# EAGLE schematic hud (EAGLE 7.6.0)
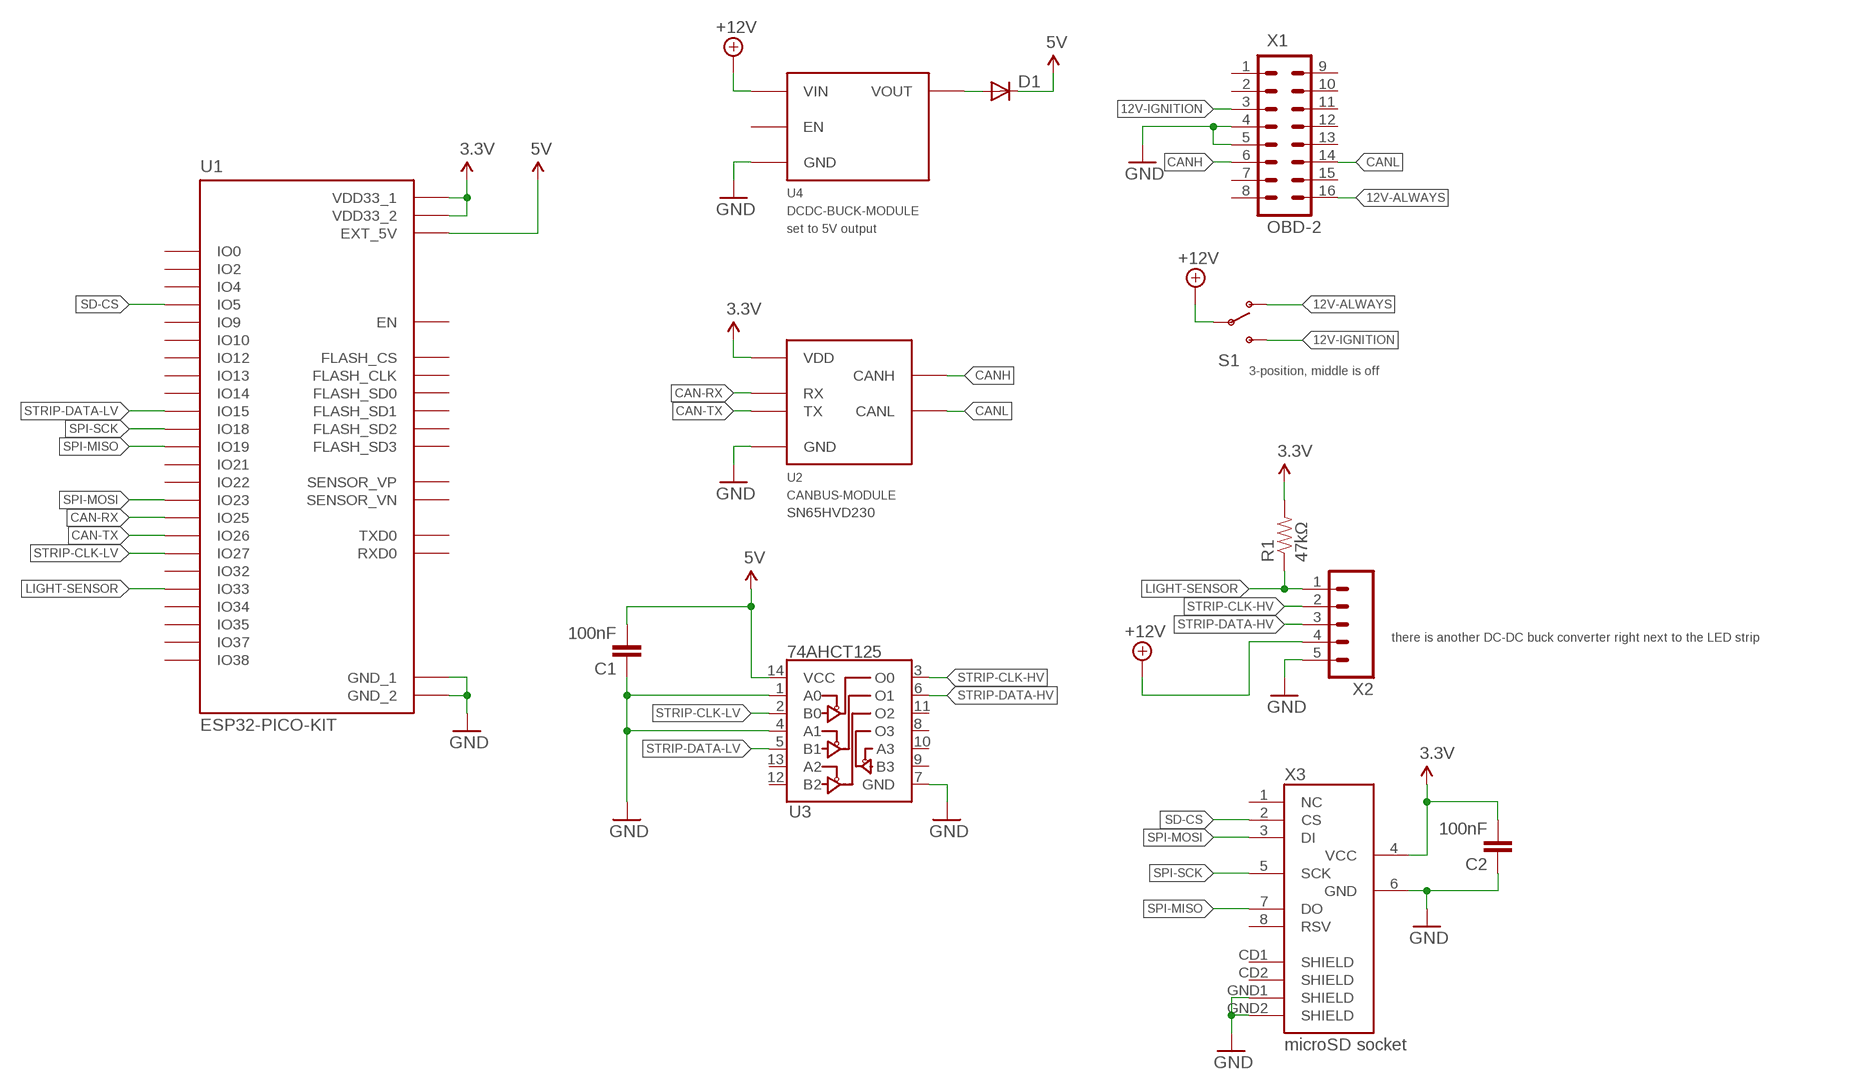
[diagram p0: schematic, sheet 1]

## Parts
C1  100nF  CAP0402-CAP  [0402-CAP]
C2  100nF  CAP0402-CAP  [0402-CAP]
D1  DIODE1N4148  [DIODE-1N4148]
R1  47kΩ  RESISTOR0805-RES  [0805]
S1  SWITCH-SPSTPTH  [SWITCH-SPDT]
U1  ESP32-PICO-KIT  [XCVR_ESP32-PICO-KIT]
U3  74AHCT125  74ACT125D  [SO014]
X1  OBD-2  M08X2  [2X8]
X2  M05PTH  [1X05]
X3  microSD socket  USD-SOCKETUSD  [USD-SOCKET-PP]

## Nets
3.3V: C2.2 R1.2 U1.J2_20(VDD33_1) U1.J3_18(VDD33_2) X3.4(VCC) ; supply symbol labelled CANBUS-MODULE
5V: C1.2 D1.C U1.J3_20(EXT_5V) U3.14(VCC)
12V-ALWAYS: S1.1(O) X1.16
12V-IGNITION: S1.3(S) X1.3
+12V: S1.2(P) X2.4 ; supply symbol labelled DCDC-BUCK-MODULE
CAN-RX: U1.J3_6(IO25) ; supply symbol labelled CANBUS-MODULE
CAN-TX: U1.J3_7(IO26) ; supply symbol labelled CANBUS-MODULE
CANH: X1.6 ; supply symbol labelled CANBUS-MODULE
CANL: X1.14 ; supply symbol labelled CANBUS-MODULE
GND: C1.1 C2.1 U1.J2_19(GND_1) U1.J3_19(GND_2) U3.1(A0) U3.4(A1) U3.7(GND) X1.4 X1.5 X2.5 X3.6(GND) X3.GND1(SHIELD) X3.GND2(SHIELD) ; supply symbol labelled CANBUS-MODULE, DCDC-BUCK-MODULE
LIGHT-SENSOR: R1.1 U1.J3_9(IO33) X2.1
SD-CS: U1.J2_9(IO5) X3.2(CS)
SPI-MISO: U1.J2_6(IO19) X3.7(DO)
SPI-MOSI: U1.J2_7(IO23) X3.3(DI)
SPI-SCK: U1.J2_8(IO18) X3.5(SCK)
STRIP-CLK-HV: U3.3(O0) X2.2
STRIP-CLK-LV: U1.J3_10(IO27) U3.2(B0)
STRIP-DATA-HV: U3.6(O1) X2.3
STRIP-DATA-LV: U1.J3_14(IO15) U3.5(B1)
VOUT: D1.A ; supply symbol labelled DCDC-BUCK-MODULE
Unconnected: U1.J2_1(FLASH_SD1) U1.J2_2(FLASH_SD3) U1.J2_3(FLASH_CLK) U1.J2_4(IO21) U1.J2_5(IO22) U1.J2_10(IO10) U1.J2_11(IO9) U1.J2_12(RXD0) U1.J2_13(TXD0) U1.J2_14(IO35) U1.J2_15(IO34) U1.J2_16(IO38) U1.J2_17(IO37) U1.J2_18(EN) U1.J3_1(FLASH_CS) U1.J3_2(FLASH_SD0) U1.J3_3(FLASH_SD2) U1.J3_4(SENSOR_VP) U1.J3_5(SENSOR_VN) U1.J3_8(IO32) U1.J3_11(IO14) U1.J3_12(IO12) U1.J3_13(IO13) U1.J3_15(IO2) U1.J3_16(IO4) U1.J3_17(IO0) U3.8(O3) U3.9(B3) U3.10(A3) U3.11(O2) U3.12(B2) U3.13(A2) X1.1 X1.2 X1.7 X1.8 X1.9 X1.10 X1.11 X1.12 X1.13 X1.15 X3.1(NC) X3.8(RSV) X3.CD1(SHIELD) X3.CD2(SHIELD)

## Notes on the sheet
- set to 5V output
- 3-position, middle is off
- SN65HVD230
- there is another DC-DC buck converter right next to the LED strip

## Library data of the parts
C1 C2 = hud:CAP: Capacitor Standard 0603 ceramic capacitor, and 0.1" leaded capacitor.
D1 = hud:DIODE: Diode These are standard reverse protection diodes and small signal diodes. SMA package can handle up to about 1A. SOD-323 can handle about 200mA. What the SOD-323 package when ordering, there are some mfgs out there that are 5-pin packages.
R1 = hud:RESISTOR: Resistor Basic schematic elements and footprints for 0603, 1206, and PTH resistors.
S1 = hud:SWITCH-SPST: SPST Switch Simple slide switch. Spark Fun Electronics SKU : COM-00102
U1 = hud:ESP32-PICO-KIT: Esp32 Wifi Bluetooth Eval Board Check availability <https://pricing.snapeda.com/parts/ESP32-PICO-KIT/Espressif%20Systems/view-part?ref=eda>; AVAILABILITY: In Stock; DESCRIPTION: - ESP32-PICO-D4 Transceiver; 802.11 b/g/n (Wi-Fi, WiFi, WLAN), Bluetooth® Smart Ready 4.x Dual Mode 2.4GHz Evaluation Board; MF: Espressif Systems; MP: ESP32-PICO-KIT; PACKAGE: None; PRICE: None; PURCHASE-URL: https://pricing.snapeda.com/search/part/ESP32-PICO-KIT/?ref=eda
U3 = hud:74ACT125D: Quad Buffer with 3-State Outputs- ON Semi Conductor: Digikey P/N MC74ACT125DR2GOSTR-ND
X1 = hud:M08X2
X2 = hud:M05: Header 5 Standard 5-pin 0.1" header. Use with straight break away headers (SKU : PRT-00116), right angle break away headers (PRT-00553), swiss pins (PRT-00743), machine pins (PRT-00117), and female headers (PRT-00115). Molex polarized connector foot print use with SKU : PRT-08230 with associated crimp pins and housings.
X3 = hud:USD-SOCKET: microSD Socket Push-push type uSD socket. Schematic element and footprint production proven. Spark Fun Electronics SKU : PRT-00127. tDoc lines correctly indicate media card edge positions when inserting (unlocked, locked, depressed).